# Altium schematic sheet Practica 7 - Motor de CD.SchDoc
size Legal; Engineer: Roberto Isaac Suaste Martinez; Organization: Mecatronica Digital; Address1: www.mecatronicadigital.com; Address2: info@mecatronicadigital.com; Address3: Dpto. Diseño Electronico
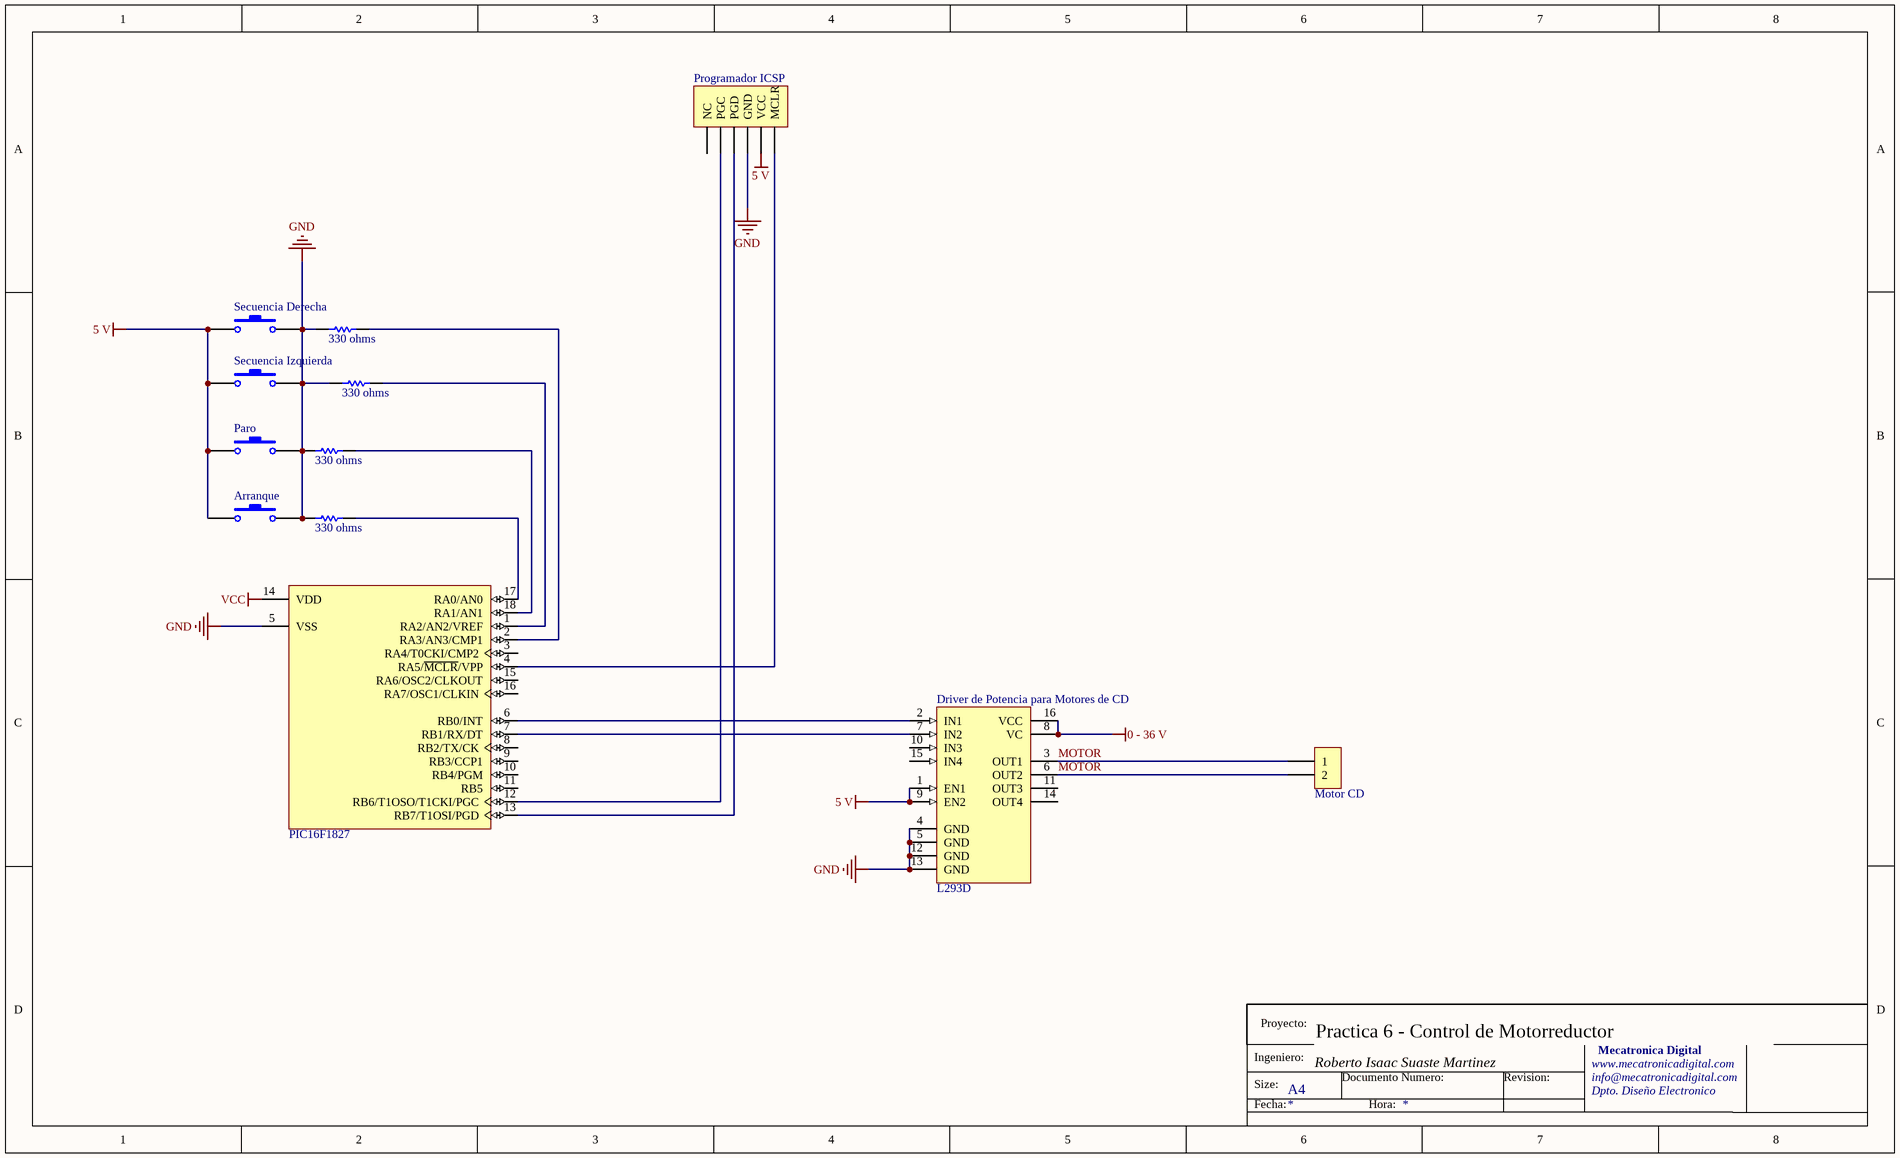
[diagram p0: Practica 7 - Motor de CD.SchDoc]

## Parts
(Parts that share a designator on the sheet are numbered #1, #2 ... from top to bottom, then left to right.)
330_ohms#1  Resistencia 1/4 de watt  [330 Ohm]  (value not drawn)
330_ohms#2  Resistencia 1/4 de watt  [330 Ohm]  (value not drawn)
330_ohms#3  Resistencia 1/4 de watt  [330 Ohm]  (value not drawn)
330_ohms#4  Resistencia 1/4 de watt  [330 Ohm]  (value not drawn)
Arranque  B_1  [Tact Switch THT 7.0mm stem]  (value not drawn)
Driver_de_Potencia_para_Motores_de_CD  L293D  [DIP16]
Motor_CD  Borne  [BORNE2]  (value not drawn)
Paro  Paro  [Tact Switch THT 7.0mm stem]  (value not drawn)
Programador_ICSP  Header 6  [Header 1X6]  (value not drawn)
Secuencia_Derecha  Secuencia Derecha  [Tact Switch THT 7.0mm stem]  (value not drawn)
Secuencia_Izquierda  Secuencia Izquierda  [Tact Switch THT 7.0mm stem]  (value not drawn)
U?  PIC16F1827  [PDIP300-P18]

## Nets
0 - 36 V: Driver_de_Potencia_para_Motores_de_CD.8(VC) Driver_de_Potencia_para_Motores_de_CD.16(VCC)
5 V: Arranque.1 Driver_de_Potencia_para_Motores_de_CD.1(EN1) Driver_de_Potencia_para_Motores_de_CD.9(EN2) Paro.1 Programador_ICSP.2(VCC) Secuencia_Derecha.1 Secuencia_Izquierda.1
GND: 330_ohms#1.1 330_ohms#2.1 330_ohms#3.1 330_ohms#4.1 Arranque.2 Driver_de_Potencia_para_Motores_de_CD.4(GND) Driver_de_Potencia_para_Motores_de_CD.5(GND) Driver_de_Potencia_para_Motores_de_CD.12(GND) Driver_de_Potencia_para_Motores_de_CD.13(GND) Paro.2 Programador_ICSP.3(GND) Secuencia_Derecha.2 Secuencia_Izquierda.2 U?.5(VSS)
VCC: U?.14(VDD)
MOTOR: Driver_de_Potencia_para_Motores_de_CD.3(OUT1) Driver_de_Potencia_para_Motores_de_CD.6(OUT2) Motor_CD.1 Motor_CD.2
Net330_ohms#1_2: 330_ohms#1.2 U?.2(RA3/AN3/CMP1)
Net330_ohms#2_2: 330_ohms#2.2 U?.1(RA2/AN2/VREF)
Net330_ohms#3_2: 330_ohms#3.2 U?.18(RA1/AN1)
Net330_ohms#4_2: 330_ohms#4.2 U?.17(RA0/AN0)
NetDriver_de_Potencia_para_Motores_de_CD_2: Driver_de_Potencia_para_Motores_de_CD.2(IN1) U?.6(RB0/INT)
NetDriver_de_Potencia_para_Motores_de_CD_7: Driver_de_Potencia_para_Motores_de_CD.7(IN2) U?.7(RB1/RX/DT)
NetProgramador_ICSP_1: Programador_ICSP.1(MCLR) U?.4(RA5/~{MCLR}/VPP)
NetProgramador_ICSP_4: Programador_ICSP.4(PGD) U?.13(RB7/T1OSI/PGD)
NetProgramador_ICSP_5: Programador_ICSP.5(PGC) U?.12(RB6/T1OSO/T1CKI/PGC)

Not connected (* = marked no-connect by the designer): Driver_de_Potencia_para_Motores_de_CD 10(IN3) 11(OUT3) 14(OUT4) 15(IN4); Programador_ICSP 6(NC); U? 3(RA4/T0CKI/CMP2) 8(RB2/TX/CK) 9(RB3/CCP1) 10(RB4/PGM) 11(RB5) 15(RA6/OSC2/CLKOUT) 16(RA7/OSC1/CLKIN)

## Notes on the sheet
- 6 - Control de Motorreductor
- Proyecto:
- Practica
- Ingeniero:
- Size:
- Fecha:
- A4
- Documento Numero:
- Hora:
- Revision:

## Library data of the parts
330_ohms#1-330_ohms#4 = Resistor 1/4 watt: Resistor empaque ceramico axial de 1/4 de watt; Published: 8-Jun-2000; LatestRevisionDate: 17-Jul-2002; LatestRevisionNote: Re-released for DXP Platform.; PackageReference: AXIAL-0.5; Publisher: Altium Limited
Arranque Paro Secuencia_Derecha Secuencia_Izquierda = Push Button: Switch; Published: 24-Mar-1999; LatestRevisionDate: 17-Jul-2002; LatestRevisionNote: Re-released for DXP Platform.; PackageReference: SPST-2; Publisher: Altium Limited
Driver_de_Potencia_para_Motores_de_CD = L293D: Push-Pull Four Channel Driver With Diode; Published: 8-Jun-2000; LatestRevisionDate: 06-Jun-2005; LatestRevisionNote: Stylized 3D Model Added.; DatasheetVersion: Jun-1996; PackageVersion: Apr-1996; PackageReference: DIP16; Publisher: Altium Limited; PackageDescription: DIP; 16 Leads; Row Spacing 7.62 mm; Pitch 2.54 mm; ComponentLink1Description: Manufacturer Link; ComponentLink1URL: http://www.st.com/; ComponentLink2Description: Datasheet; ComponentLink2URL: http://www.st.com/stonline/products/literature/ds/1330/l293d.pdf
Motor_CD = Borne2: Terminal Atornillable 2 salidas
Programador_ICSP = Header 6: Header, 6-Pin; LatestRevisionDate: 17-Jul-2002; LatestRevisionNote: Re-released for DXP Platform.; Publisher: Altium Limited
U? = PIC16F628A-I/P: FLASH-Based 8-Bit CMOS Microcontroller with nanoWatt Technology, 2K (x14-Bit words) FLASH, 224 Bytes SRAM, 18-Pin PDIP, 3.0 to 5.5V Supply Range, Industrial Temperature; Published: 11-Oct-2004; LatestRevisionDate: 29-Jan-2009; LatestRevisionNote: Sch. layout revised. 3D Model Removed.; DatasheetVersion: revF, Mar-2007; PackageVersion: revBB, Aug-2009; PackageReference: PDIP300-P18; Publisher: Altium Limited; PackageDescription: 18-Lead Plastic Dual In-Line (P) - 300 mil Body [PDIP]; Supplier 1: Digi-Key; Supplier Part Number 1: PIC16F628A-I/P-ND; Supplier 2: Farnell; Supplier Part Number 2: 9771549; Supplier 3: Farnell; Supplier Part Number 3: 1523938; Supplier 4: Farnell; Supplier Part Number 4: 9760423; Code_JEDEC: MS-001; ComponentLink1Description: Datasheet; ComponentLink1URL: http://ww1.microchip.com/downloads/en/DeviceDoc/40044F.pdf; ComponentLink2Description: Packaging Specification; ComponentLink2URL: http://www.microchip.com/stellent/groups/techpub_sg/documents/packagingspec/en012702.pdf; ComponentLink3Description: Microchip.com Home; ComponentLink3URL: http://www.microchip.com/